# Altium schematic sheet cpu.SchDoc
size A3; SheetNumber: 1; SheetTotal: 7
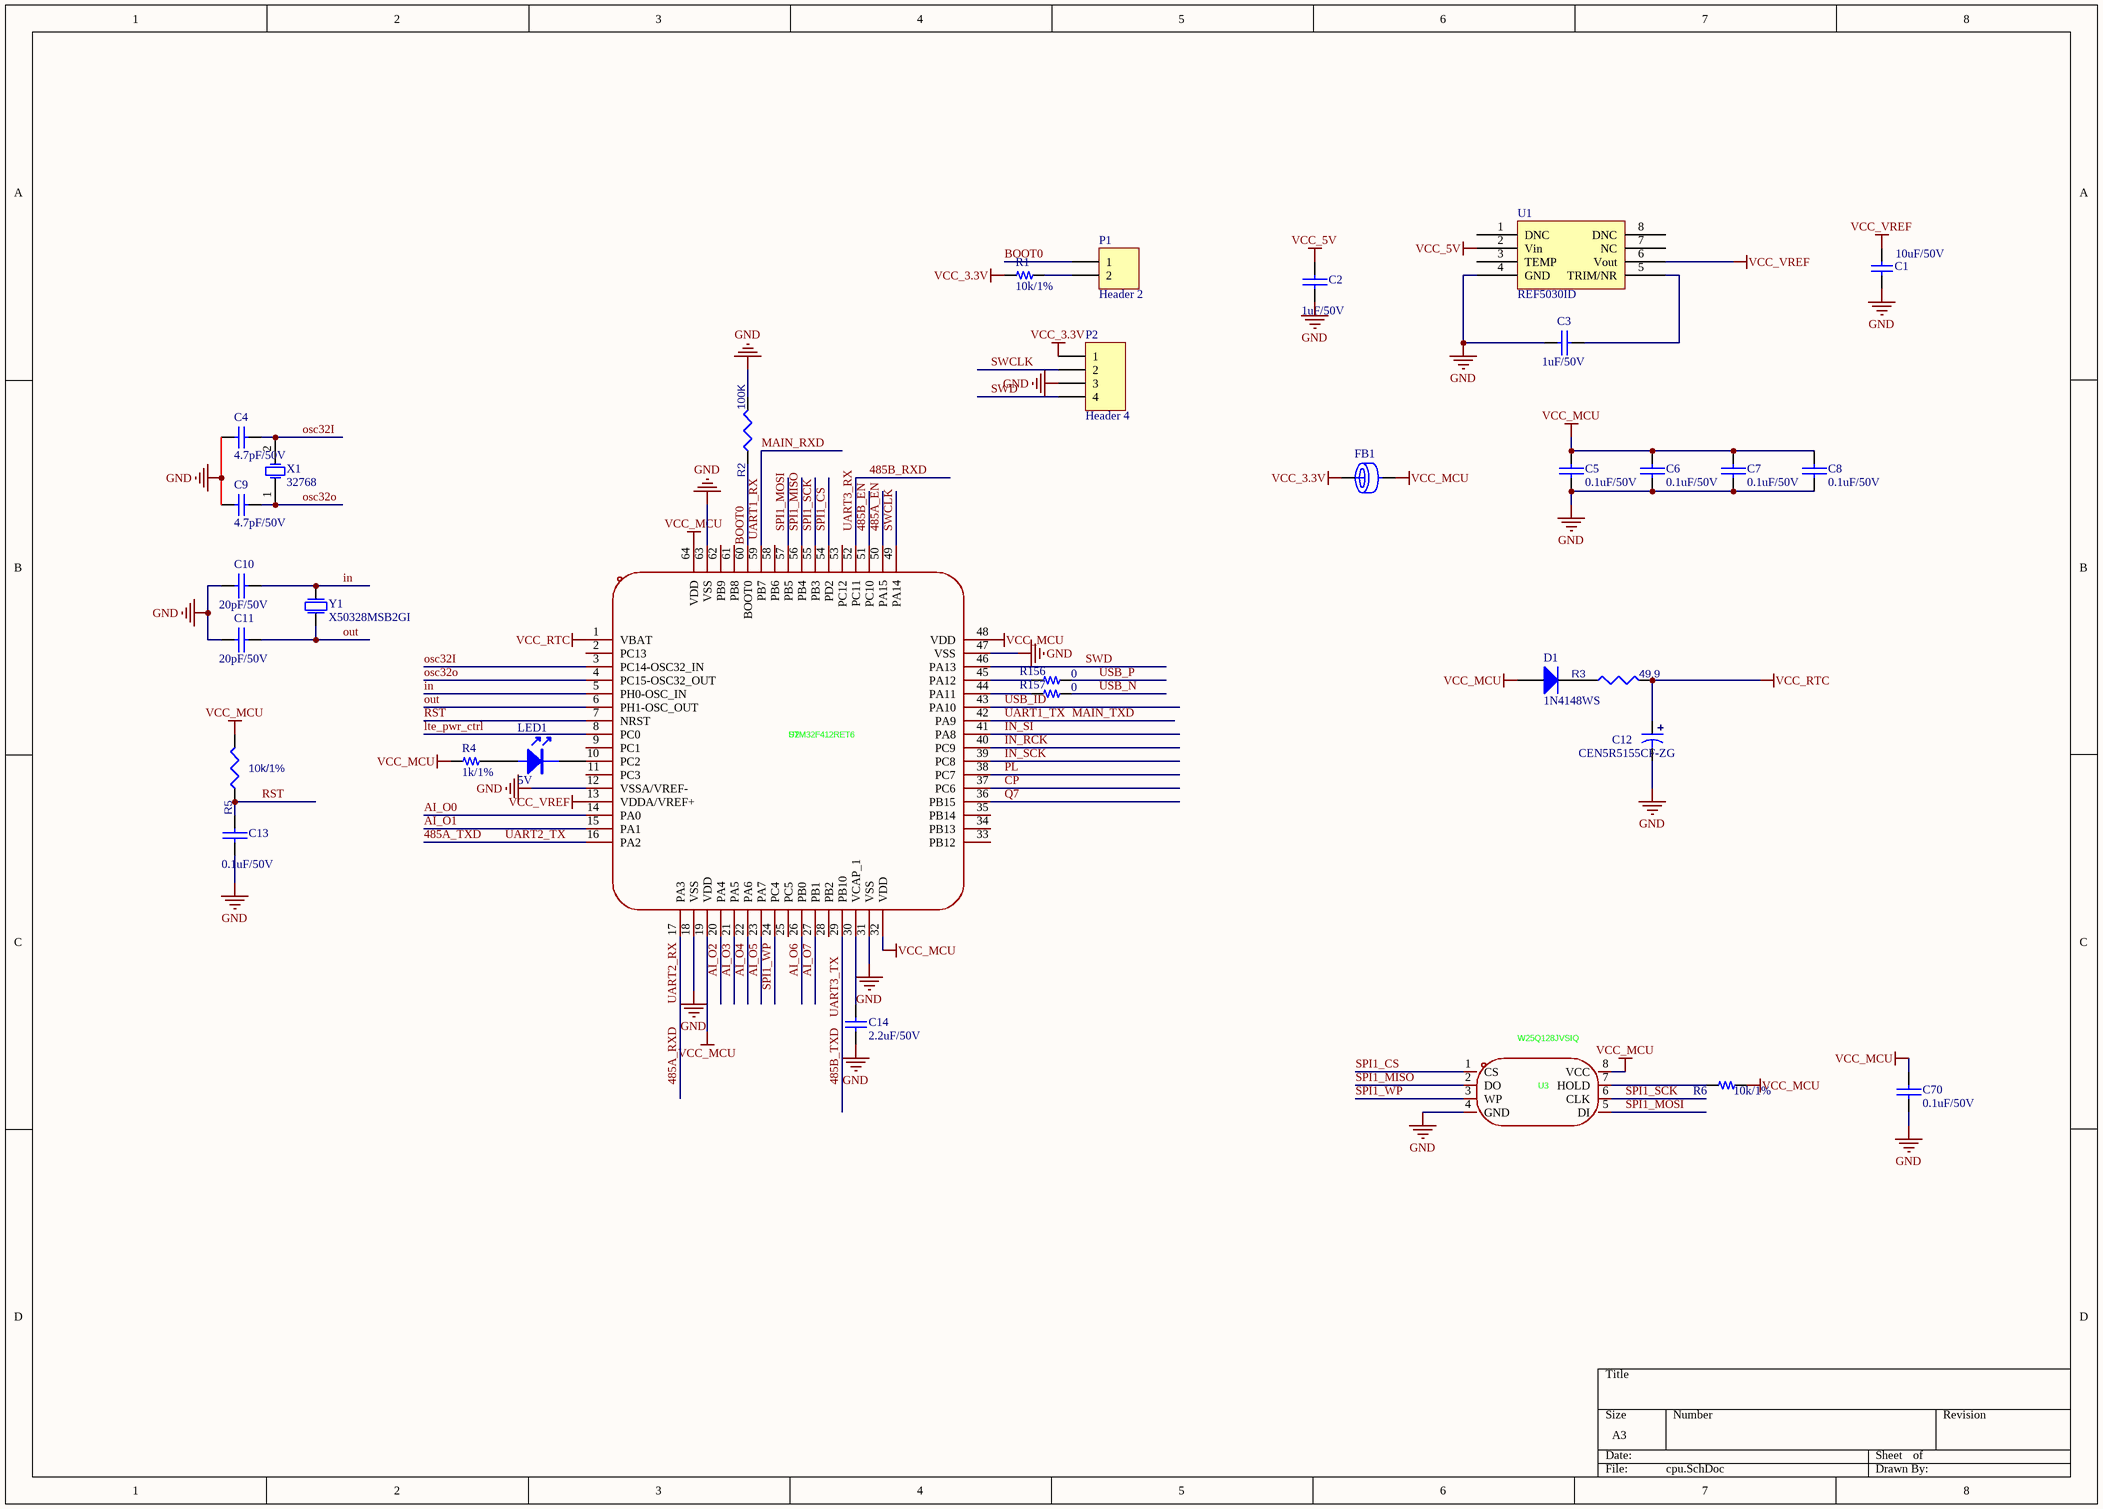
[diagram p0: cpu.SchDoc]

## Parts
C1  10uF/50V  [CAPC2012X127N_0805]
C2  1uF/50V  [CAPC1608X092N_0603]
C3  1uF/50V  [CAPC1608X092N_0603]
C4  4.7pF/50V  [0603C]
C5  0.1uF/50V  [CAPC1608X092N_0603]
C6  0.1uF/50V  [CAPC1608X092N_0603]
C7  0.1uF/50V  [CAPC1608X092N_0603]
C8  0.1uF/50V  [CAPC1608X092N_0603]
C9  4.7pF/50V  [0603C]
C10  value 20pF/50V  [CAPC1608X092N_0603]  (hidden comment: 20pF/25V)
C11  value 20pF/50V  [CAPC1608X092N_0603]  (hidden comment: 20pF/25V)
C12  CEN5R5155CF-ZG  [CAP-TH_BD21.0-P5.00-D0.8_CENXXX-CF]
C13  0.1uF/50V  [CAPC1608X092N_0603]
C14  2.2uF/50V  [0603C]
C70  0.1uF/50V  [CAPC1608X092N_0603]
D1  1N4148WS  [SOD323]
FB1  FBC0603  [FBC0603]  (value not drawn)
LED1  5V  [0603LED]
P1  Header 2  [HDR1X2]
P2  Header 4  [HDR1X4]
R1  10k/1%  [RESC1608X055N_0603]
R2  100K  [0603R]
R3  49.9  [0603R]
R4  1k/1%  [RESC1608X055N_0603]
R5  10k/1%  [0603R]
R6  10k/1%  [RESC1608X055N_0603]
R156  0  [RESC1608X055N_0603]  (no BOM)
R157  0  [RESC1608X055N_0603]  (no BOM)
U1  REF5030ID  [SO-8]
U2  STM32F412RET6  [LQFP-64]
U3  W25Q128JVSIQ  [so-8]
X1  32768  [A]
Y1  X50328MSB2GI  [CRAY_5032]

## Nets
GND: C1.1 C2.1 C3.2 C4.2 C5.1 C6.1 C7.1 C8.1 C9.2 C10.2 C11.2 C12.2 C13.1 C14.2 C70.1 P2.3 R2.2 U1.4(GND) U2.12(VSSA/VREF-) U2.18(VSS) U2.31(VSS) U2.47(VSS) U2.63(VSS) U3.4(GND)
VCC_3.3V: FB1.1 P2.1 R1.1
VCC_5V: C2.2 U1.2(Vin)
VCC_MCU: C5.2 C6.2 C7.2 C8.2 C70.2 D1.1(A) FB1.2 R4.2 R5.2 R6.1 U2.19(VDD) U2.32(VDD) U2.48(VDD) U2.64(VDD) U3.8(VCC)
VCC_RTC: C12.1 R3.2 U2.1(VBAT)
VCC_VREF: C1.2 U1.6(Vout) U2.13(VDDA/VREF+)
485A_EN: U2.50(PA15)
485A_RXD: U2.17(PA3)  [also labelled UART2_RX]
485A_TXD: U2.16(PA2)  [also labelled UART2_TX]
485B_EN: U2.51(PC10)
485B_RXD: U2.52(PC11)  [also labelled UART3_RX]
485B_TXD: U2.29(PB10)  [also labelled UART3_TX]
AI_O0: U2.14(PA0)
AI_O1: U2.15(PA1)
AI_O2: U2.20(PA4)
AI_O3: U2.21(PA5)
AI_O4: U2.22(PA6)
AI_O5: U2.23(PA7)
AI_O6: U2.26(PB0)
AI_O7: U2.27(PB1)
BOOT0: P1.1 R2.1 U2.60(BOOT0)
CP: U2.37(PC6)
in: C10.1 U2.5(PH0-OSC_IN) Y1.1(P1)
IN_RCK: U2.40(PC9)
IN_SCK: U2.39(PC8)
IN_SI: U2.41(PA8)
lte_pwr_ctrl: U2.8(PC0)
MAIN_RXD: U2.59(PB7)  [also labelled UART1_RX]
MAIN_TXD: U2.42(PA9)  [also labelled UART1_TX]
osc32I: C4.1 U2.3(PC14-OSC32_IN) X1.2(OSC2)
osc32o: C9.1 U2.4(PC15-OSC32_OUT) X1.1(OSC1)
out: C11.1 U2.6(PH1-OSC_OUT) Y1.2(P2)
PL: U2.38(PC7)
Q7: U2.36(PB15)
RST: C13.2 R5.1 U2.7(NRST)
SPI1_CS: U2.54(PD2) U3.1(CS)
SPI1_MISO: U2.56(PB4) U3.2(DO)
SPI1_MOSI: U2.57(PB5) U3.5(DI)
SPI1_SCK: U2.55(PB3) U3.6(CLK)
SPI1_WP: U2.24(PC4) U3.3(WP)
SWCLK: P2.2 U2.49(PA14)
SWD: P2.4 U2.46(PA13)
USB_ID: U2.43(PA10)
USB_N: R157.1
USB_P: R156.1
NetC3_1: C3.1 U1.5(TRIM/NR)
NetC14_1: C14.1 U2.30(VCAP_1)
NetD1_2: D1.2(K) R3.1
NetLED1_1: LED1.1 R4.1
NetLED1_2: LED1.2 U2.10(PC2)
NetP1_2: P1.2 R1.2
NetR6_2: R6.2 U3.7(HOLD)
NetR156_2: R156.2 U2.45(PA12)
NetR157_2: R157.2 U2.44(PA11)

Not connected (* = marked no-connect by the designer): U1 1(DNC) 3(TEMP) 7(NC) 8(DNC); U2 2(PC13) 9(PC1) 11(PC3) 25(PC5) 28(PB2) 33(PB12) 34(PB13) 35(PB14) 53(PC12) 58(PB6) 61(PB8) 62(PB9)

## Library data of the parts
C1 = Cap: PartNumber: CL21A106KBYQNNE; Value: 10uF/50V; Package: 0805
C2 C3 C13 = CAP: PartNumber: CL10A105KB8NNNC; Package: 0603
  C2 C3: Value: 1uF/50V
  C13: Value: 0.1uF/50V
C4 = Cap: Capacitor; Value: 4.7pF
C5-C8 C70 = CAP: PartNumber: CC0603KRX7R9BB104; Value: 0.1uF/50V; Package: 0603
C9 C14 = Cap: Capacitor
  C14: Value: 2.2uF/50V
C10 C11 = CAP: PartNumber: CC0603JRNPO9BN200; Package: 0603
C12 = CAP2: 电解电容
D1 = DIODE
FB1 = FBC0603: PartNumber: BLM18AG601SN1D; Value: 600 Ohms @ 100MHz
LED1 = LED: Package: 0603
P1 = Header 2: Header, 2-Pin
P2 = Header 4: Header, 4-Pin
R1 R4 R6 R156 R157 = R: PartNumber: RC0603FR-071KL; Package: 0603
  R1 R6: Value: 10k/1%
  R4: Value: 1k/1%
  R156 R157: Value: 0
R2 R3 = RESISTOR_0
  R2: Value: 100K
  R3: Value: 49.9
R5 = RESISTOR_0: Value: 10K
U1 = REF5030: PartNumber: REF5030IDR; Value: REF5030ID
U3 = XL1509-5.0
X1 = XTAL: Crystal Oscillator
Y1 = XTAL: Value: X50328MSB2GI; PartNumber: X50328MSB2GI